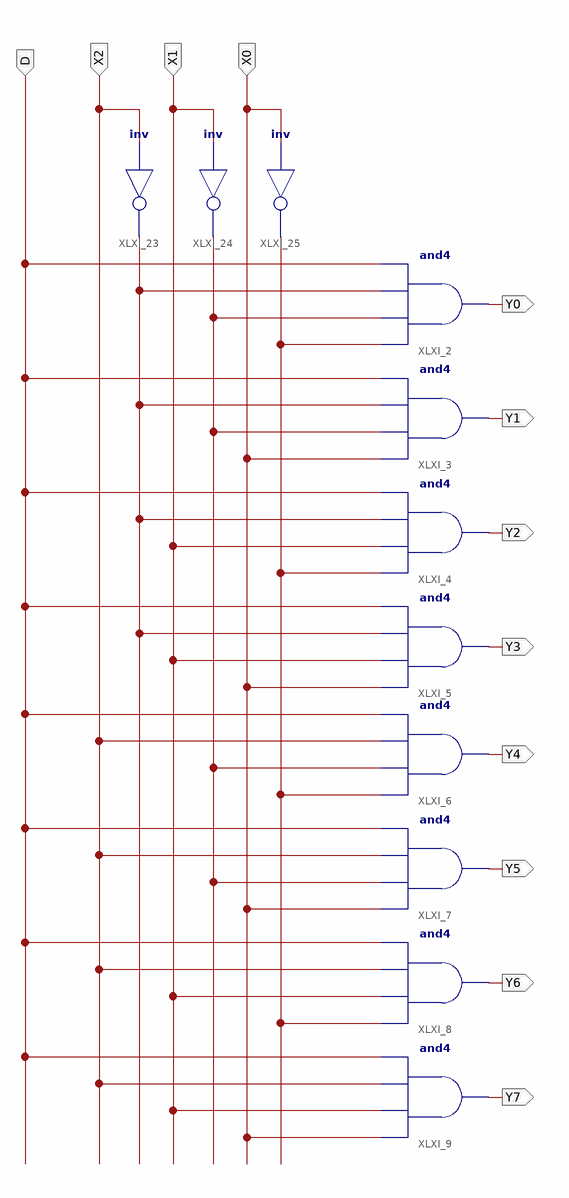
[diagram p0: schematic sheet 1]
// Xilinx ISE schematic Scheme2.sch (virtex5) as structural Verilog: 11 symbols, 12 ports
module Scheme2 (
  input  D,
  input  X1,
  input  X0,
  input  X2,
  output Y0,
  output Y1,
  output Y2,
  output Y3,
  output Y4,
  output Y5,
  output Y6,
  output Y7
);

  wire XLXN_47, XLXN_51, XLXN_55;

  and XLXI_2 (Y0, XLXN_47, XLXN_55, XLXN_51, D);
  and XLXI_3 (Y1, X0, XLXN_55, XLXN_51, D);
  and XLXI_4 (Y2, XLXN_47, X1, XLXN_51, D);
  and XLXI_5 (Y3, X0, X1, XLXN_51, D);
  and XLXI_6 (Y4, XLXN_47, XLXN_55, X2, D);
  and XLXI_7 (Y5, X0, XLXN_55, X2, D);
  and XLXI_8 (Y6, XLXN_47, X1, X2, D);
  and XLXI_9 (Y7, X0, X1, X2, D);
  not XLXI_23 (XLXN_51, X2);
  not XLXI_24 (XLXN_55, X1);
  not XLXI_25 (XLXN_47, X0);
endmodule
